# Altium schematic sheet ESP_Grow_Main_V2_0_Title.SchDoc: Title Page
size A; Author: Kyle R; DocumentNumber: 3282021; Revision: A; SheetNumber: 0; SheetTotal: 5
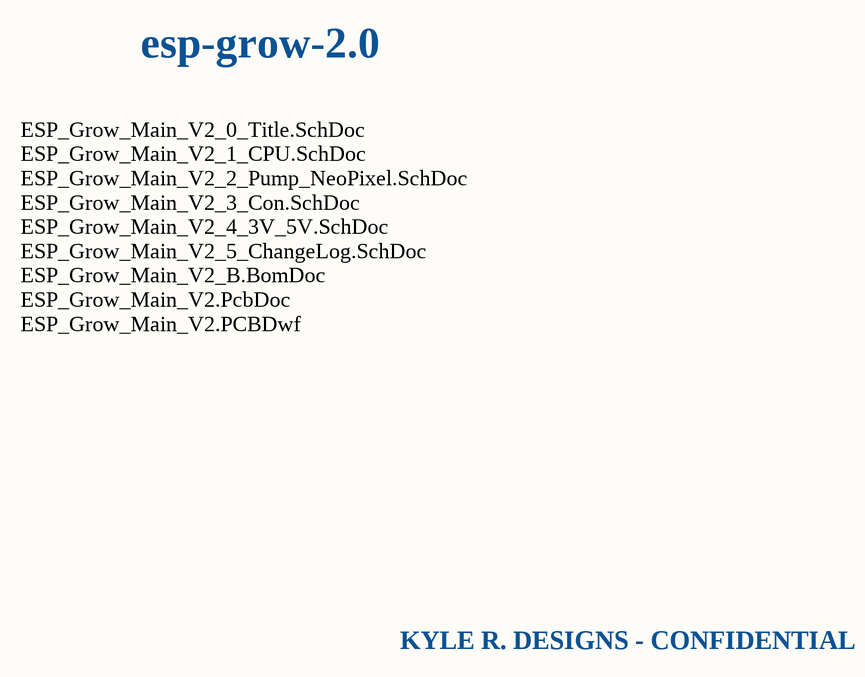
[diagram p0: ESP_Grow_Main_V2_0_Title.SchDoc]

## Notes on the sheet
- esp-grow-2.0
- ESP_Grow_Main_V2_0_Title.SchDoc
  ESP_Grow_Main_V2_1_CPU.SchDoc
  ESP_Grow_Main_V2_2_Pump_NeoPixel.SchDoc
  ESP_Grow_Main_V2_3_Con.SchDoc
  ESP_Grow_Main_V2_4_3V_5V.SchDoc
  ESP_Grow_Main_V2_5_ChangeLog.SchDoc
  ESP_Grow_Main_V2_B.BomDoc
  ESP_Grow_Main_V2.PcbDoc
  ESP_Grow_Main_V2.PCBDwf
- KYLE R. DESIGNS - CONFIDENTIAL